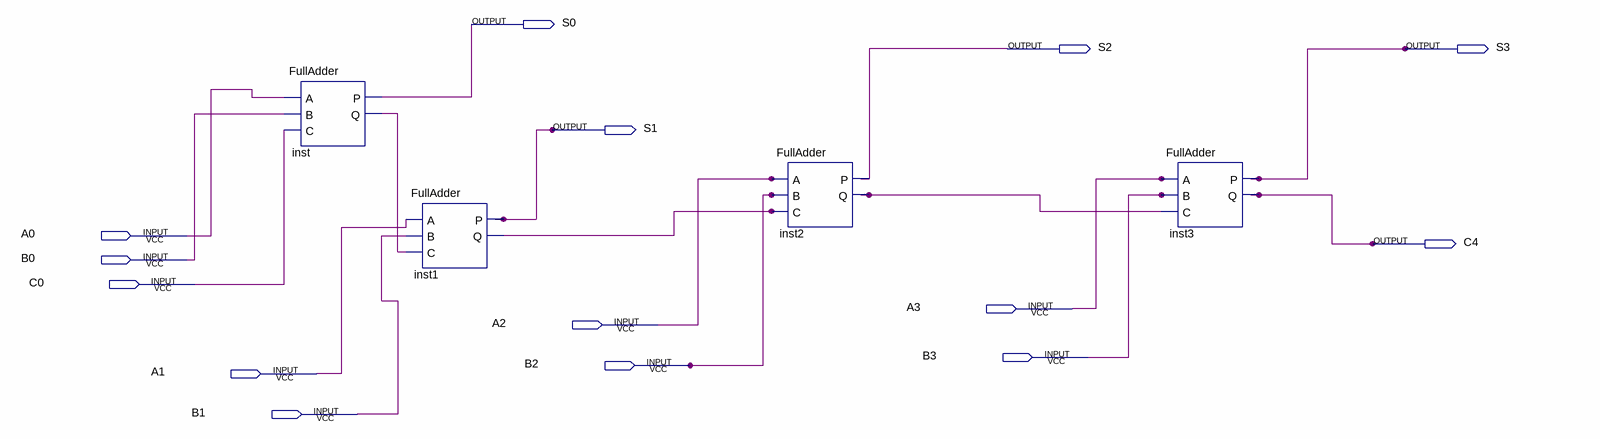
[diagram p0: schematic sheet]
// Quartus schematic RippleCarryAdder.bdf as structural Verilog: 4 symbols, 14 pins
module RippleCarryAdder (
  input  A0,
  input  B0,
  input  C0,
  input  A3,
  input  A2,
  input  B3,
  input  B2,
  input  A1,
  input  B1,
  output S0,
  output S2,
  output S3,
  output S1,
  output C4
);

  wire inst1_q, inst2_q, inst_q;

  FullAdder inst (.A(A0), .B(B0), .C(C0), .P(S0), .Q(inst_q));
  FullAdder inst1 (.A(A1), .B(B1), .C(inst_q), .P(S1), .Q(inst1_q));
  FullAdder inst2 (.A(A2), .B(B2), .C(inst1_q), .P(S2), .Q(inst2_q));
  FullAdder inst3 (.A(A3), .B(B3), .C(inst2_q), .P(S3), .Q(C4));
endmodule
